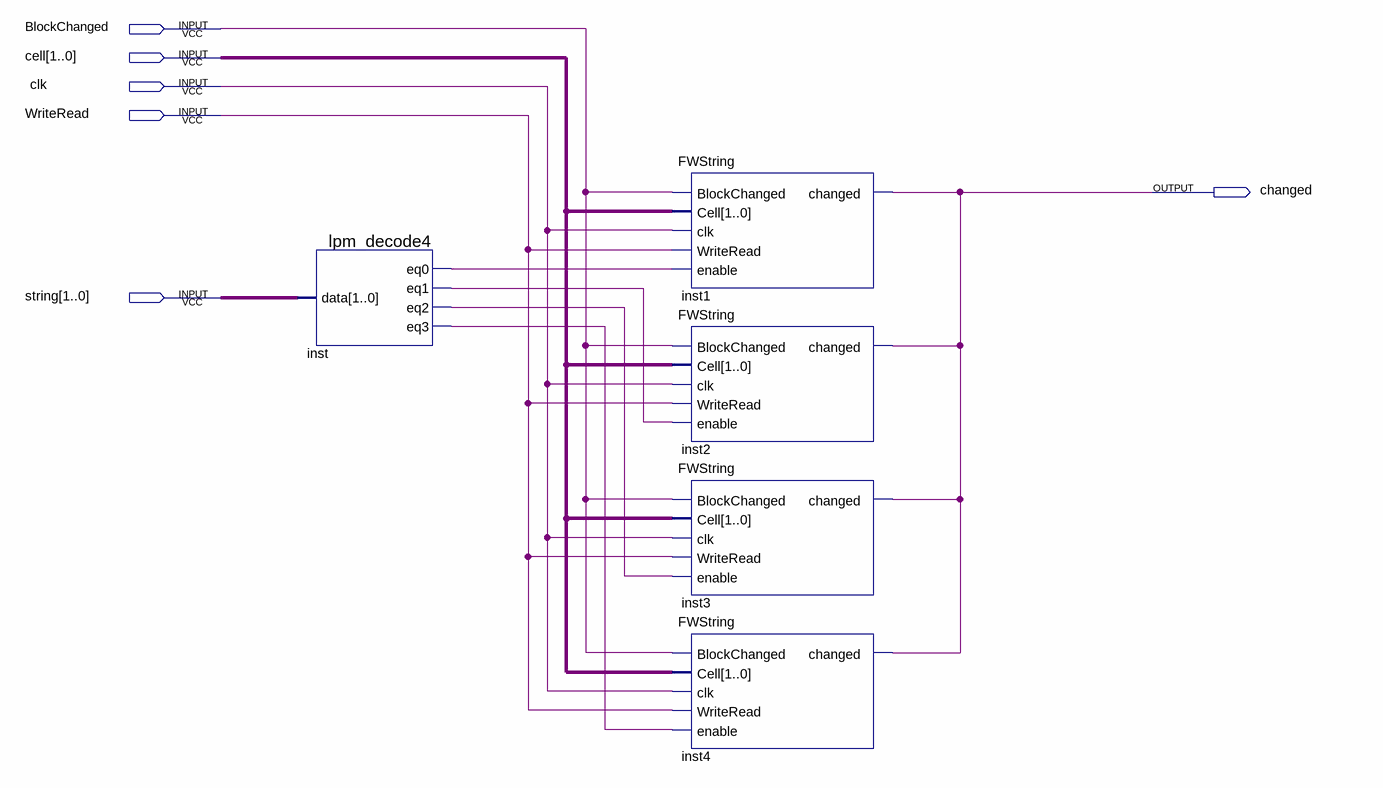
[diagram p0: schematic sheet]
// Quartus schematic CacheFlags.bdf as structural Verilog: 5 symbols, 6 pins
module CacheFlags (
  input  BlockChanged,
  input  [1:0] \cell ,
  input  clk,
  input  WriteRead,
  input  [1:0] \string ,
  output changed
);

  wire inst_eq0, inst_eq1, inst_eq2, inst_eq3;

  lpm_decode4 inst (.data(\string ), .eq0(inst_eq0), .eq1(inst_eq1), .eq2(inst_eq2), .eq3(inst_eq3));
  FWString inst1 (
    .BlockChanged(BlockChanged), .Cell(\cell ), .clk(clk), .WriteRead(WriteRead), .enable(inst_eq0),
    .changed(changed));
  FWString inst2 (
    .BlockChanged(BlockChanged), .Cell(\cell ), .clk(clk), .WriteRead(WriteRead), .enable(inst_eq1),
    .changed(changed));
  FWString inst3 (
    .BlockChanged(BlockChanged), .Cell(\cell ), .clk(clk), .WriteRead(WriteRead), .enable(inst_eq2),
    .changed(changed));
  FWString inst4 (
    .BlockChanged(BlockChanged), .Cell(\cell ), .clk(clk), .WriteRead(WriteRead), .enable(inst_eq3),
    .changed(changed));
endmodule
